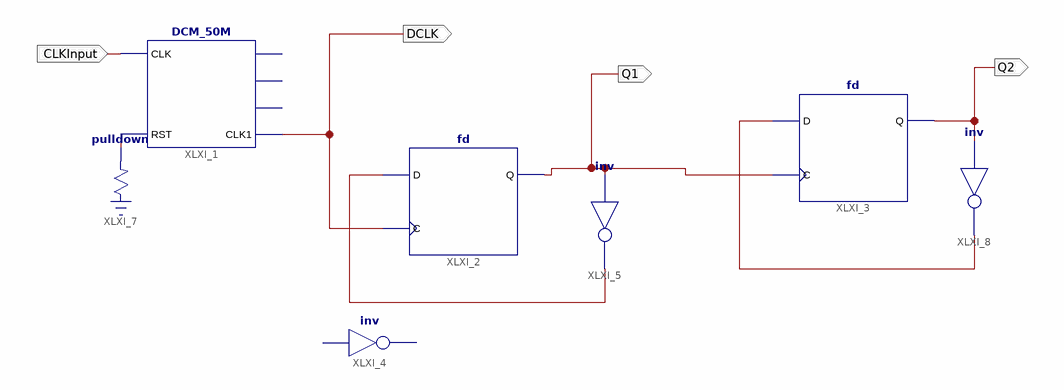
[diagram p0: schematic sheet 1]
// Xilinx ISE schematic lab8_experiment1.sch (spartan3e) as structural Verilog: 7 symbols, 4 ports
module lab8_experiment1 (
  input  CLKInput,
  output Q1,
  output DCLK,
  output Q2
);

  wire XLXN_5, XLXN_6, XLXN_9;

  DCM_50M XLXI_1 (.CLK(CLKInput), .RST(XLXN_5), .CLK1(DCLK));  // open: CLK1M, CLK10k, CLK1k
  fd XLXI_2 (.C(DCLK), .D(XLXN_6), .Q(Q1));
  fd XLXI_3 (.C(Q1), .D(XLXN_9), .Q(Q2));
  // inv XLXI_4 is placed but not wired
  not XLXI_5 (XLXN_6, Q1);
  \pulldown  XLXI_7 (.O(XLXN_5));
  not XLXI_8 (XLXN_9, Q2);
endmodule
